# Altium project EE411 Solar Phone Charger.PrjPcb
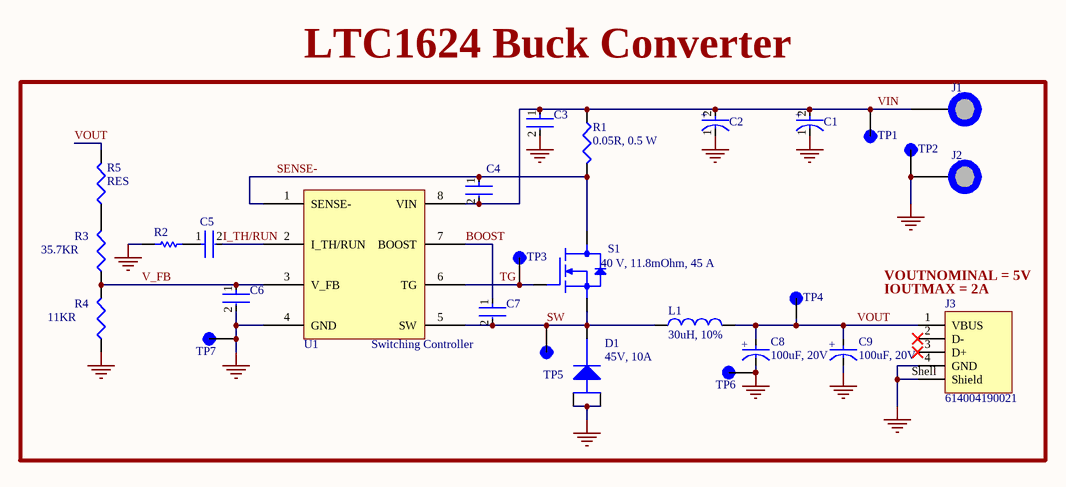
[diagram p0: Solar_Phone_Charger.SchDoc]
1 sheet, 28 parts. Net scope: global (net labels, ports and power ports of the same name join across sheets).
Board file: Solar_Phone_Charger.PcbDoc

## Sheet Solar_Phone_Charger.SchDoc
size A; SheetNumber: 1; SheetTotal: 1

### Parts
C1  T495X336M035ATE100  [FP-T495X336M035ATE100-MFG]  (value not drawn)
C2  T495X336M035ATE100  [FP-T495X336M035ATE100-MFG]  (value not drawn)
C3  C1206C104J5RACTU  [FP-C1206C-EB-MFG]  (value not drawn)
C4  C1206C102F1GACTU  [FP-C1206C-EB-MFG]  (value not drawn)
C5  C0805C471J5GAC7210  [FP-C0805C-DN-MFG]  (value not drawn)
C6  C0805C101K5GAC7210  [FP-C0805C-DN-MFG]  (value not drawn)
C7  C1206C104J5RACTU  [FP-C1206C-EB-MFG]  (value not drawn)
C8  100uF, 20V  [FP-TR3D-MFG]
C9  100uF, 20V  [FP-TR3D-MFG]
D1  45V, 10A  [PowerDI5]
J1  4MM Banana Female Socket  [4MM Banana Female Socket]  (value not drawn)
J2  4MM Banana Female Socket  [4MM Banana Female Socket]  (value not drawn)
J3  614004190021  [614004190021]
L1  30uH, 10%  [ERU24]
R1  0.05R, 0.5 W  [R1206]
R2  ERA8AEB682V  [RESC3216X70X50NL20T25]  (value not drawn)
R3  35.7KR  [R1206]
R4  11KR  [R1206]
R5  RES  [R1206]
S1  40 V, 11.8mOhm, 45 A  [DPAKSWITCH]
TP1  5287  [KEYSTONE_5287]  (value not drawn)
TP2  5287  [KEYSTONE_5287]  (value not drawn)
TP3  5287  [KEYSTONE_5287]  (value not drawn)
TP4  5287  [KEYSTONE_5287]  (value not drawn)
TP5  5287  [KEYSTONE_5287]  (value not drawn)
TP6  5287  [KEYSTONE_5287]  (value not drawn)
TP7  5287  [KEYSTONE_5287]  (value not drawn)
U1  Switching Controller  [LTC1624]

### Nets
GND: C1.1(C) C2.1(C) C3.2 C6.2 C8.1(C) C9.1(C) D1.1 D1.2 J2.1 J3.4(GND) J3.Shell(Shield) R2.1 R4.1 TP2.1(TP) TP6.1(TP) TP7.1(TP) U1.4(GND)
BOOST: C7.1 U1.7(BOOST)
I_TH/RUN: C5.2 U1.2(I_TH/RUN)
SENSE-: C4.1 R1.2 S1.2(D) U1.1(SENSE-)
SW: C7.2 D1.3 L1.1 S1.3(S) TP5.1(TP) U1.5(SW)
TG: S1.1(G) TP3.1(TP) U1.6(TG)
V_FB: C6.1 R3.1 R4.2 U1.3(V_FB)
VIN: C1.2(A) C2.2(A) C3.1 C4.2 J1.1 R1.1 TP1.1(TP) U1.8(VIN)
VOUT: C8.2(A) C9.2(A) J3.1(VBUS) L1.2 R5.2 TP4.1(TP)
NetC5_1: C5.1 R2.2
NetR3_2: R3.2 R5.1

Not connected (* = marked no-connect by the designer): J3 2(D-)* 3(D+)*

### Notes on the sheet
- LTC1624 Buck Converter
- (near J3) VOUTNOMINAL = 5V
- (near J3) IOUTMAX = 2A
- (in symbol CMP-00030-44433242-1) +
- (in symbol CMP-03017-000065-1) +

### Library data of the parts
C1 C2 = CMP-03017-000065-1: CAP TANT 33UF 20% 35V 2917; Polarity: Polar; Dissipation Factor: 6%; ESR (Equivalent Series Resistance): 100mR; Case Code (Imperial): 2917; Termination: SMD/SMT; Radiation Hardening: No; Width: 4.3mm; Case Code (Metric): 7343; Depth: 4.3mm; Height: 4.3mm; Capacitance: 33uF; Series: T495; Max Operating Temperature: 125°C; Voltage Rating (DC): 35V; Construction: Flat; Min Operating Temperature: -55°C; Packaging: Tape and Reel; Length: 7.3mm; RoHS Compliant: Yes; Tolerance: 20%; Case/Package: Molded; Weight: 0.023634oz; Voltage Rating: 35V
C3 C7 = CMP-03020-003996-1: Multilayer Ceramic Capacitor, C Series, 0.1 - F, - 5%, X7r, 50 V, 1206 [3216 Metric] Rohs Compliant: Yes; Manufacturer: KEMET; Capacitance: 0.10 μF; Automotive Grade: Grade 0; Voltage Rating: 50 V; Value: 0.10 μF; Temperature Coefficient: 15%; Tolerance: 0.05; Height: 0.88mm; Package: C1206C-EB; Octopart: https://octopart.com/c1206c104j5ractu-kemet-110335; Temperature Range Low: -55°C; Temperature: -55°C to +150°C; Manufacturer Part Number: C1206C104J5RACTU; ComponentLink2URL: https://content.kemet.com/datasheets/KEM_C1007_X8R_ULTRA_150C_SMD.pdf; Device Class L3: Ceramic Capacitors; ComponentLink2Description: Datasheet; Automotive: Yes; Material: Ceramic; Category: Cap; Temperature Range High: +150°C; Lead Free: Yes; RoHS: TRUE; Device Class L2: Capacitors; Temperature Characteristic: X7R; Digikey Description: Multilayer Ceramic Capacitor, C Series, 0.1 - F, - 5%, X7r, 50 V, 1206 [3216 Metric] Rohs Compliant: Yes; Mouser Description: Cap Ceramic 0.1uF 50V X7R 5% SMD 1206 125°C Plastic T/R; Ipc Land Pattern Name: CAPC320160X78; Device Class L1: Passive Components
C4 = CMP-03020-013132-1: CAP CER 1000PF 100V 1% NP0 1206; Manufacturer: KEMET; Temperature Coefficient: 15%; Material: Ceramic; Capacitance: 1,000 pF; Tolerance: 0.01; Value: 1,000 pF; Temperature Characteristic: C0G; Automotive Grade: Grade 0; Device Class L1: Passive Components; Temperature Range High: +150°C; Category: Cap; Digikey Description: CAP CER 1000PF 100V 1% NP0 1206; Automotive: Yes; Lead Free: Yes; Temperature Range Low: -55°C; ComponentLink2URL: https://content.kemet.com/datasheets/KEM_C1007_X8R_ULTRA_150C_SMD.pdf; RoHS: TRUE; Octopart: https://octopart.com/c1206c102f1gactu-kemet-17062505; Mouser Description: Multilayer Ceramic Capacitors MLCC - SMD/SMT 100volts 1000pF C0G 1%; Manufacturer Part Number: C1206C102F1GACTU; Temperature: -55°C to +150°C; Voltage Rating: 100 V; Height: 0.88mm; Ipc Land Pattern Name: CAPC320160X78; ComponentLink2Description: Datasheet; Device Class L3: Ceramic Capacitors; Package: C1206C-EB; Device Class L2: Capacitors
C5 = CMP-03020-030339-1: C0805 470 pF C0G 30ppm/°C 5.00% 50 V; Manufacturer: KEMET; Capacitance: 470 pF; Material: Ceramic; Value: 470 pF; Tolerance: 0.05; Voltage Rating: 50 V; Device Class L3: Ceramic Capacitors; Ipc Land Pattern Name: CAPC200125X78; ComponentLink2Description: Datasheet; ComponentLink2URL: https://content.kemet.com/datasheets/KEM_C1003_C0G_SMD.pdf; Mouser Description: Multilayer Ceramic Capacitors MLCC - SMD/SMT 50volts 470pF C0G 5%; Temperature Coefficient: 30ppm/°C; Device Class L2: Capacitors; Temperature Range High: +125°C; RoHS: TRUE; Automotive: No; Package: C0805C-DN; Temperature Range Low: -55°C; Temperature: -55°C to +125°C; Device Class L1: Passive Components; Temperature Characteristic: C0G; Manufacturer Part Number: C0805C471J5GAC7210; Lead Free: Yes; Category: Cap; Height: 0.88mm; Octopart: https://octopart.com/c0805c471j5gac7210-kemet-3901141
C6 = CMP-03020-002806-2: C0805 100 pF C0G 30ppm/°C 10.00% 50 V; Manufacturer: KEMET; Value: 100 pF; Voltage Rating: 50 V; Material: Ceramic; Tolerance: 0.1; Lead Free: Yes; Device Class L1: Passive Components; Temperature Range Low: -55°C; Temperature: -55°C to +125°C; Octopart: https://octopart.com/c0805c101k5gac7210-kemet-11759675; Category: Cap; Device Class L2: Capacitors; ComponentLink2Description: Datasheet; Temperature Range High: +125°C; Height: 0.88mm; Device Class L3: Ceramic Capacitors; Temperature Coefficient: 30ppm/°C; Manufacturer Part Number: C0805C101K5GAC7210; Capacitance: 100 pF; Automotive: No; ComponentLink2URL: https://content.kemet.com/datasheets/KEM_C1003_C0G_SMD.pdf; RoHS: TRUE; Package: C0805C-DN; Temperature Characteristic: C0G; Ipc Land Pattern Name: CAPC200125X78
C8 C9 = CMP-00030-44433242-1: TR3D107K020C0080 Surface Mount Tantalum Capacitor, 100 uF, 20 V, ± 10%, -55 °C, 125 °C, 2917 [7343-31 Metric]; Capacitance: 100µF; ESR (Equivalent Series Resistance): 80mΩ; Ripple Current: 1.37A; Leakage Current: 20µA; Dissipation Factor: 8%; Polarity: Polar; Height - Seated (Max): 3.0988mm; RoHS: Compliant; Case Code (Imperial): 2917; Radiation Hardening: No; Mount: Surface Mount; Voltage Rating: 20V; Width: 4.3mm; Height: 3.1mm; Termination: SMD/SMT; Case Code (Metric): 7343; REACH SVHC: Unknown; NexarPartId: 44433242; Length: 7.3mm; Features: General Purpose; Tolerance: 10%; Voltage Rating (DC): 20V; Depth: 4.3mm; Max Operating Temperature: 125°C; Lead Free: Lead Free; Case/Package: 2917; Schedule B: 8532210050, 8532210050; Packaging: Tape and Reel; Min Operating Temperature: -55°C
D1 = SDT10A45P5-13D: Diode Schottky 45V 10A 5-Pin PowerDI T/R; Manufacturer: Diodes; Supplier: Digikey; Supplier Part Number: 31-SDT10A45P5-13DCT-ND; Manufacturer Part Number: SDT10A45P5-13D; RoHS: Yes; Stock: 4970; Pricing: 1=0.51, 10=0.394, 100=0.2362, 500=0.21866, 1000=0.14869, 2000=0.13689 (USD); Reach SVHC Compliant: No; ComponentLink1URL: https://datasheet.ciiva.com:443/pdfs/VipMasterIC/IC/DIOD/DIOD-S-A0008345900/DIOD-S-A0008345900-1.pdf?src-supplier=IHS+Markit; ComponentLink1Description: https://datasheet.ciiva.com:443/pdfs/VipMasterIC/IC/DIOD/DIOD-S-A0008345900/DIOD-S-A0008345900-1.pdf?src-supplier=IHS+Markit
J3 = CMP-1502-03228-2: NexarPartId: 71472441; Connector Type: USB; Operating Supply Voltage: 30V; Contact Resistance: 30mΩ; Number of Contacts: 4; USB Standard: USB 2.0; Current Rating: 3A; Gender: Receptacle; Insulation Resistance: 1GΩ; REACH SVHC: No SVHC; Housing Color: White; Min Operating Temperature: -40°C; Insulation Material: PBT; Contact Material: Brass; Mount: Horizontal, Through Hole; Contact Plating: Gold; Max Operating Temperature: 85°C; Orientation: Horizontal; RoHS: Compliant; Number of Pins: 4
L1 = B82559A0303A024: General Purpose Inductor, 30uH, 10%, 1 Element, Ferrite-Core, SMD, 9790; Manufacturer: TDK; Supplier 1: Digikey; Manufacturer Part Number: B82559A0303A024; RoHS: Yes; Category: Fixed Inductors; Stock 1: 910; Pricing 1: 1=8.34, 10=7.194, 25=6.6724 (USD); Supplier Part Number 1: 495-B82559A0303A024CT-ND
R1 = KDV12DR050ET: Fixed Resistor, Metal Film, 0.5W, 0.05ohm, 0.5% +/-Tol, 100ppm/Cel, Surface Mount, 1206; Manufacturer: Ohmite; Supplier: Digikey; Supplier Part Number: 273-KDV12DR050ETCT-ND; Manufacturer Part Number: KDV12DR050ET; RoHS: No; Category: Chip SMD Resistors; Stock: 2206; Pricing: 1=0.46, 10=0.312, 25=0.2428, 50=0.179, 100=0.1245, 250=0.10856, 500=0.0895, 1000=0.06475 (USD); RoHS Compliant: Yes
R2 = CMP-2003-04491-1: Manufacturer: Panasonic; Part Number: ERA8AEB682V
R3 = ERA-8ARW3572V: 1206 Thin Film Chip Resistor / 1206 SMD Resistor 0.05% 10PPM 35.7 Kohm; Manufacturer: Panasonic; Supplier: Digikey; Supplier Part Number: P18836CT-ND; Manufacturer Part Number: ERA-8ARW3572V; RoHS: Yes; Category: Chip SMD Resistors; Stock: 958; Pricing: 1=1.53, 10=1.056, 50=0.7948, 100=0.6991, 500=0.54712 (USD); ComponentLink1URL: https://industrial.panasonic.com/cdbs/www-data/pdf/RDM0000/AOA0000C307.pdf?src-supplier=Digikey; ComponentLink1Description: https://industrial.panasonic.com/cdbs/www-data/pdf/RDM0000/AOA0000C307.pdf?src-supplier=Digikey
R4 = ERA-8ARW113V: Fixed Resistor, Thin Film, 0.25W, 11000ohm, 150V, 0.05% +/-Tol, 10ppm/Cel, Surface Mount, 1206; Manufacturer: Panasonic; Power: 250mW; Rated Temperature: 85°C; Temperature Coefficient: 10ppm/°C; Package Height: 0.6mm; Package Length: 3.2mm; Package Width: 1.6mm; Reference Standard: AEC-Q200; Supplier: Digikey; Supplier Part Number: P11KCTCT-ND; Manufacturer Part Number: ERA-8ARW113V; RoHS: Yes; Category: Chip SMD Resistors; Stock: 4456; Pricing: 1=1.53, 10=1.056, 50=0.7948, 100=0.6991, 500=0.54712 (USD); Mounting Technology: Surface Mount; Pins: 2; Case/Package: 1206; Terminal Finish: Nickel; Min Operating Temperature: -55°C; Max Operating Temperature: 155°C; Tolerance: 0.05%; JESD-609 Code: e3; Resistor Type: FIXED RESISTOR; Construction: Rectangular; Package Style: SMTMeter; Packaging: Tape and Reel; Value: 11kR; Technology: THIN FILM; Termination: Wraparound; Working Voltage: 150V; Reach SVHC Compliant: Yes; RoHS Compliant: Yes; ComponentLink1URL: https://datasheet.ciiva.com:443/pdfs/VipMasterIC/IC/PANA/PANA-S-A0009459258/PANA-S-A0009459258-1.pdf?src-supplier=IHS+Markit; ComponentLink1Description: https://datasheet.ciiva.com:443/pdfs/VipMasterIC/IC/PANA/PANA-S-A0009459258/PANA-S-A0009459258-1.pdf?src-supplier=IHS+Markit; ComponentLink2URL: https://media.digikey.com/pdf/Data%20Sheets/Panasonic%20Resistors%20Thermistors%20PDFs/ERA_Series_LE.pdf?src-supplier=Digikey; ComponentLink2Description: https://media.digikey.com/pdf/Data%20Sheets/Panasonic%20Resistors%20Thermistors%20PDFs/ERA_Series_LE.pdf?src-supplier=Digikey; ComponentLink3URL: http://www.farnell.com/datasheets/1937238.pdf?src-supplier=Farnell; ComponentLink3Description: http://www.farnell.com/datasheets/1937238.pdf?src-supplier=Farnell; ComponentLink4URL: http://www.farnell.com/datasheets/1937238.pdf?src-supplier=Element14; ComponentLink4Description: http://www.farnell.com/datasheets/1937238.pdf?src-supplier=Element14
R5 = RES: Generic 1206 Resistor; Manufacturer: Panasonic; Manufacturer Part Number: ERA-8ARW3572V; Supplier: Digikey; Supplier Part Number: P18836CT-ND; RoHS: Yes; Category: Chip SMD Resistors; Stock: 958; Pricing: 1=1.53, 10=1.056, 50=0.7948, 100=0.6991, 500=0.54712 (USD); ComponentLink1URL: https://industrial.panasonic.com/cdbs/www-data/pdf/RDM0000/AOA0000C307.pdf?src-supplier=Digikey; ComponentLink1Description: https://industrial.panasonic.com/cdbs/www-data/pdf/RDM0000/AOA0000C307.pdf?src-supplier=Digikey
S1 = NVD5C478NLT4G: Single N-Channel Power MOSFET, 40V, 45A, 7.7mΩ DPAK 2500 tape and reel; Manufacturer: ON Semiconductor; Supplier 1: Digikey; Manufacturer Part Number: NVD5C478NLT4G; RoHS: Yes; Category: MOSFETs; Stock 1: 6434; Pricing 1: 1=1.65, 10=1.368, 100=1.0891, 500=0.92158, 1000=0.78194 (USD); Reach SVHC Compliant: No; ComponentLink1URL: https://datasheet.ciiva.com:443/pdfs/VipMasterIC/IC/ONSM/ONSM-S-A0004900107/ONSM-S-A0004903403-1.pdf?src-supplier=IHS+Markit; ComponentLink1Description: https://datasheet.ciiva.com:443/pdfs/VipMasterIC/IC/ONSM/ONSM-S-A0004900107/ONSM-S-A0004903403-1.pdf?src-supplier=IHS+Markit; ComponentLink2URL: http://www.onsemi.com/pub/Collateral/NVD5C478NL-D.PDF?src-supplier=Digikey; ComponentLink2Description: http://www.onsemi.com/pub/Collateral/NVD5C478NL-D.PDF?src-supplier=Digikey; Supplier Part Number 1: NVD5C478NLT4GOSCT-ND
TP1-TP7 = 5287: Blue Test Point; Value: *; MP: 5287; Availability: Unavailable; Price: None; Package: None
U1 = LTC1624IS8#TRPBF: Switching Controller, Current-mode, 2A, 225kHz Switching Freq-Max, CMOS, PDSO8; Manufacturer: Analog Devices / Linear Technology; Package Body Material: Plastic; Control Technique: PULSE WIDTH MODULATION; Max Supply Voltage: 36V; Min Input Voltage: 3.5V; Nominal Supply Voltage: 15V; Channels: 1; Switcher Configuration: SINGLE; Time @ Peak Reflow Temperature-Max (s): 30s; Qualification Status: Not Qualified; Supplier 1: Digikey; Manufacturer Part Number: LTC1624IS8#TRPBF; RoHS: Yes; Category: Voltage Regulators - Switching; Stock 1: 2084; Pricing 1: 1=11.26, 10=10.351, 25=9.9216, 100=8.7419, 250=8.3128, 500=7.7765, 1000=7.13292 (USD); Case/Package: SOP; Pins: 8; Package Shape: Rectangular; Terminal Finish: Tin; Min Operating Temperature: -40°C; Max Operating Temperature: 85°C; JESD-609 Code: e3; Throw Configuration: SWITCHING CONTROLLER; Control Mode: CURRENT-MODE; JESD-30 Code: R-PDSO-G8; Moisture Sensitivity Level: 1; Max Output current: 2A; Package Style: SMALL OUTLINEMeter; Peak Reflow Temperature (Cel): 260°C; Surface Mount: Yes; Frequency: 225kHz; Technology: CMOS; Terminal Form: Gull Wing; Terminal Position: DUAL; Length: 4.9025mm; Width: 3.899mm; Height - Seated (Max): 1.752mm; Terminal Pitch: 1.27mm; Temperature Grade: INDUSTRIAL; Reach SVHC Compliant: Yes; RoHS Compliant: Yes; ComponentLink1URL: https://datasheet.ciiva.com:443/pdfs/VipMasterIC/IC/LITC/LITCS09260/LITCS09260-1.pdf?src-supplier=IHS+Markit; ComponentLink1Description: https://datasheet.ciiva.com:443/pdfs/VipMasterIC/IC/LITC/LITCS09260/LITCS09260-1.pdf?src-supplier=IHS+Markit; ComponentLink2URL: https://datasheet.ciiva.com/15110/getdatasheetpartid-44556-15110797.pdf?src-supplier=Verical; ComponentLink2Description: https://datasheet.ciiva.com/15110/getdatasheetpartid-44556-15110797.pdf?src-supplier=Verical; Supplier Part Number 1: 505-LTC1624IS8#TRPBFCT-ND